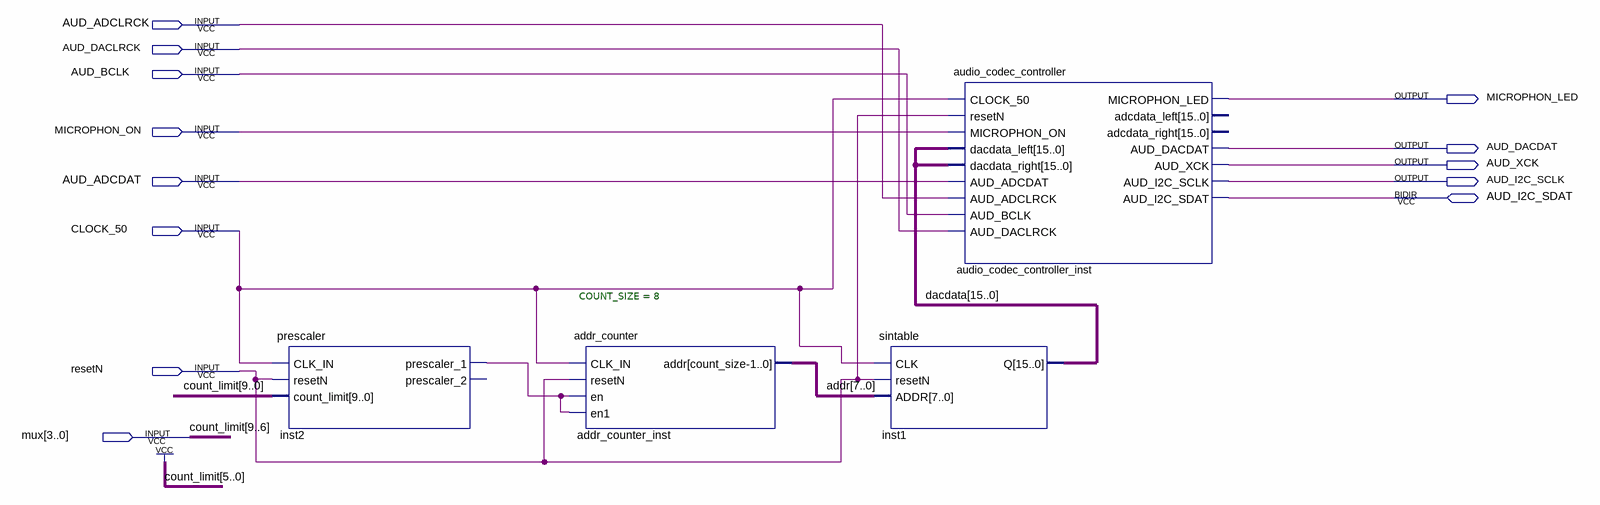
[diagram p0: schematic sheet]
// Quartus schematic experiment_sinus_generator.bdf as structural Verilog: 4 symbols, 13 pins
module experiment_sinus_generator (
  input  AUD_ADCLRCK,
  input  AUD_DACLRCK,
  input  AUD_BCLK,
  input  MICROPHON_ON,
  input  AUD_ADCDAT,
  input  CLOCK_50,
  input  resetN,
  input  [3:0] mux,
  inout  AUD_I2C_SDAT,
  output MICROPHON_LED,
  output AUD_DACDAT,
  output AUD_XCK,
  output AUD_I2C_SCLK
);

  wire inst2_prescaler_1;
  wire [7:0] addr;
  wire [15:0] dacdata;

  prescaler inst2 (
    .CLK_IN(CLOCK_50), .resetN(resetN), .count_limit({mux, {6{1'b1}}}), .prescaler_1(inst2_prescaler_1));  // open: prescaler_2
  addr_counter #(.COUNT_SIZE(8)) addr_counter_inst (
    .CLK_IN(CLOCK_50), .resetN(resetN), .en(inst2_prescaler_1), .en1(inst2_prescaler_1), .addr(addr));
  sintable inst1 (.CLK(CLOCK_50), .resetN(resetN), .ADDR(addr), .Q(dacdata));
  audio_codec_controller audio_codec_controller_inst (
    .CLOCK_50(CLOCK_50), .resetN(resetN), .MICROPHON_ON(MICROPHON_ON), .dacdata_left(dacdata),
    .dacdata_right(dacdata), .AUD_ADCDAT(AUD_ADCDAT), .AUD_ADCLRCK(AUD_ADCLRCK), .AUD_BCLK(AUD_BCLK),
    .AUD_DACLRCK(AUD_DACLRCK), .MICROPHON_LED(MICROPHON_LED), .AUD_DACDAT(AUD_DACDAT), .AUD_XCK(AUD_XCK),
    .AUD_I2C_SCLK(AUD_I2C_SCLK), .AUD_I2C_SDAT(AUD_I2C_SDAT));  // open: adcdata_left, adcdata_right

  // Other names for the same wires on the sheet: count_limit[9:6] = mux
endmodule
